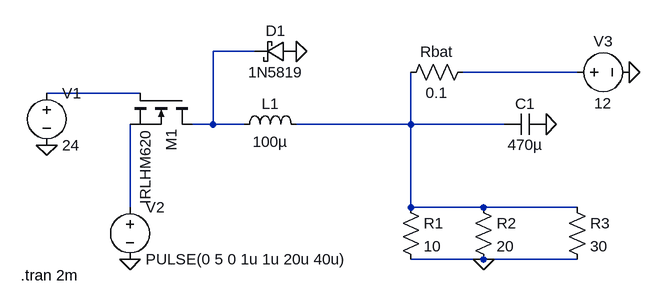
[diagram p0: schematic Simu2.asc]
Simu2.asc, the LTspice schematic file:
Version 4.1
SHEET 1 996 680
WIRE 400 80 336 80
WIRE 896 112 720 112
WIRE 224 144 80 144
WIRE 336 192 336 80
WIRE 336 192 304 192
WIRE 384 192 336 192
WIRE 640 192 640 112
WIRE 640 192 464 192
WIRE 784 192 640 192
WIRE 208 320 208 192
WIRE 640 320 640 192
WIRE 752 320 640 320
WIRE 896 320 752 320
WIRE 752 400 640 400
WIRE 896 400 752 400
FLAG 80 224 0
FLAG 464 80 0
FLAG 752 400 0
FLAG 976 112 0
FLAG 848 192 0
FLAG 208 400 0
SYMBOL voltage 80 128 R0
WINDOW 123 0 0 Left 0
WINDOW 39 0 0 Left 0
SYMATTR InstName V1
SYMATTR Value 24
SYMBOL nmos 304 144 R90
SYMATTR InstName M1
SYMATTR Value IRLHM620
SYMBOL voltage 208 304 R0
WINDOW 123 0 0 Left 0
WINDOW 39 0 0 Left 0
SYMATTR InstName V2
SYMATTR Value PULSE(0 5 0 1u 1u 20u 40u)
SYMBOL ind 368 208 R270
WINDOW 0 32 56 VTop 2
WINDOW 3 5 56 VBottom 2
SYMATTR InstName L1
SYMATTR Value 100µ
SYMATTR SpiceLine Rser=1m
SYMBOL schottky 464 64 R90
WINDOW 0 0 32 VBottom 2
WINDOW 3 32 32 VTop 2
SYMATTR InstName D1
SYMATTR Value 1N5819
SYMATTR Description Diode
SYMATTR Type diode
SYMBOL cap 848 176 R90
WINDOW 0 0 32 VBottom 2
WINDOW 3 32 32 VTop 2
SYMATTR InstName C1
SYMATTR Value 470µ
SYMBOL res 624 304 R0
SYMATTR InstName R1
SYMATTR Value 10
SYMBOL res 736 304 R0
SYMATTR InstName R2
SYMATTR Value 20
SYMBOL res 880 304 R0
SYMATTR InstName R3
SYMATTR Value 30
SYMBOL res 736 96 R90
WINDOW 0 0 56 VBottom 2
WINDOW 3 32 56 VTop 2
SYMATTR InstName Rbat
SYMATTR Value 0.1
SYMBOL voltage 880 112 R270
WINDOW 0 32 56 VTop 2
WINDOW 3 -32 56 VBottom 2
WINDOW 123 0 0 Left 0
WINDOW 39 0 0 Left 0
SYMATTR InstName V3
SYMATTR Value 12
TEXT 40 424 Left 2 !.tran 2m

The netlist it stands for:
* Simu2.asc
V1 N003 0 24
M1 N001 N003 N005 N005 IRLHM620
V2 N005 0 PULSE(0 5 0 1u 1u 20u 40u)
L1 N001 N004 100µ Rser=1m
D1 0 N001 1N5819
C1 0 N004 470µ
R1 N004 0 10
R2 N004 0 20
R3 N004 0 30
Rbat N002 N004 0.1
V3 N002 0 12
.model D D
.lib standard.dio
.model NMOS NMOS
.model PMOS PMOS
.lib standard.mos
.tran 2m
.backanno
.end